# EasyEDA Pro project easyeda-pro-v2.2-format-example.epro

# Schematic Schematic1

## Sheets
1 P1: Board Name: Board1; Create Date: 2026-08-03; Page Name: P1; Project Name: easyeda-pro-v2.2-format-example; Schematic Name: Schematic1; Update Date: 2026-08-03; Company: 嘉立创EDA; Page Size: A4; Version: V1.0
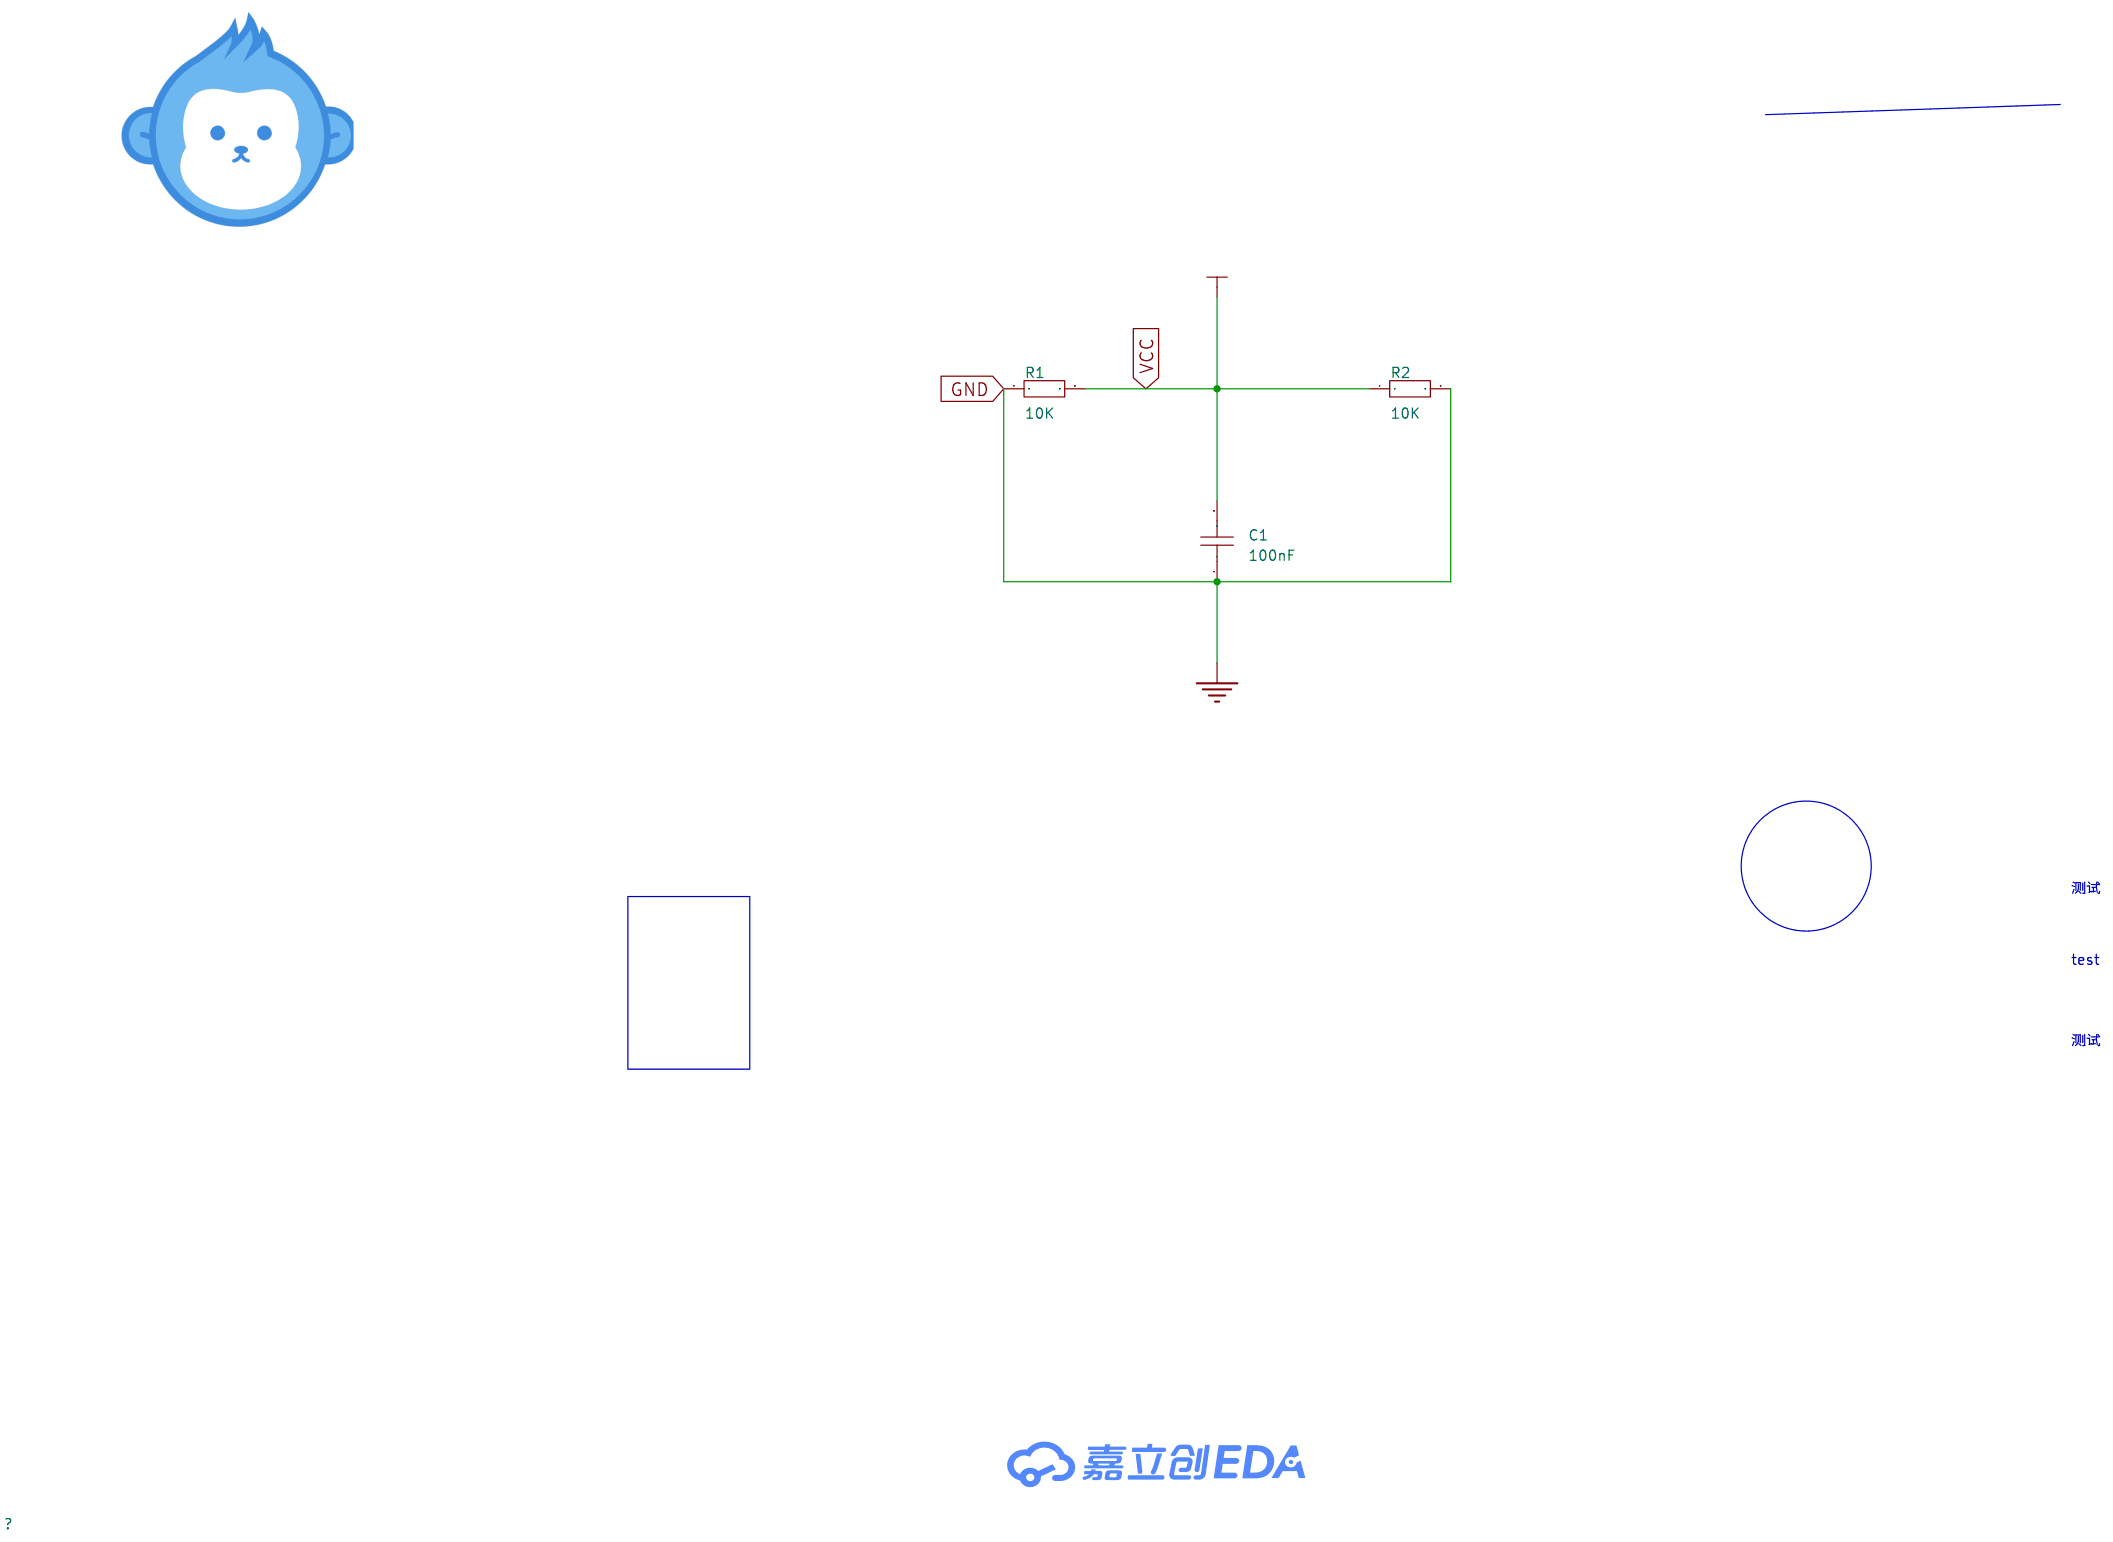
[diagram p0: P1]
2 P2: Page Name: P2
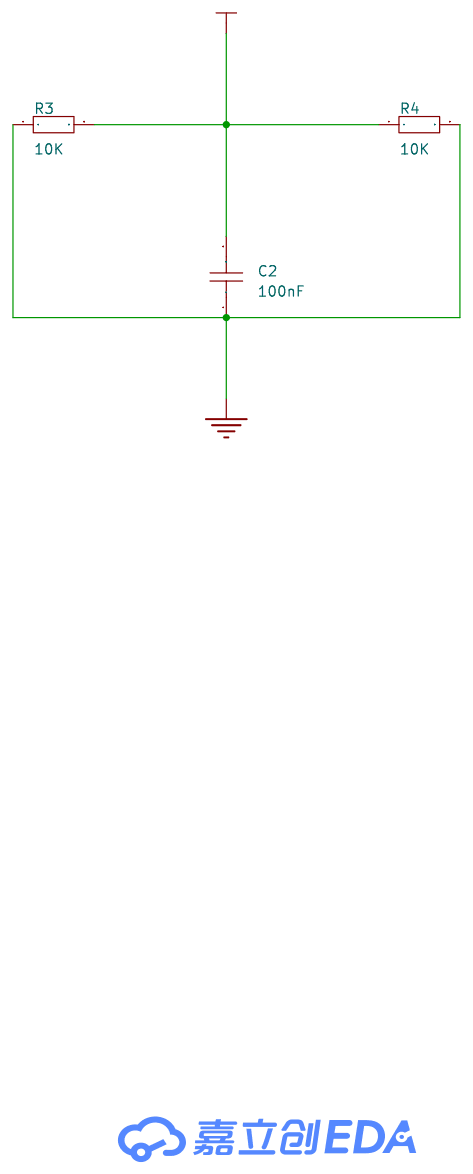
[diagram p1: P2]

## Parts
sheet P1
C1  100nF  [C0603]
R1  10K  [R0603]
R2  10K  [R0603]
sheet P2
C2  100nF  [C0603]
R3  10K  [R0603]
R4  10K  [R0603]

## Library data of the parts
C1 C2 = CAP_0603: Supplier Footprint: 0603
R1-R4 = Res_0603: Supplier Footprint: 0603

## Nets
GND: C1.1 C2.1 R1.1 R2.2 R3.1 R4.2
VCC: C1.2 C2.2 R1.2 R2.1 R3.2 R4.1

## Notes on the sheets
sheet 1
- 测试
- test
- 测试

# Schematic Schematic2
Board Name: Board2; Create Date: 2026-08-03; Page Name: P1; Project Name: easyeda-pro-v2.2-format-example; Schematic Name: Schematic2; Update Date: 2026-08-03; Company: 嘉立创EDA; Page Size: A4; Version: V1.0
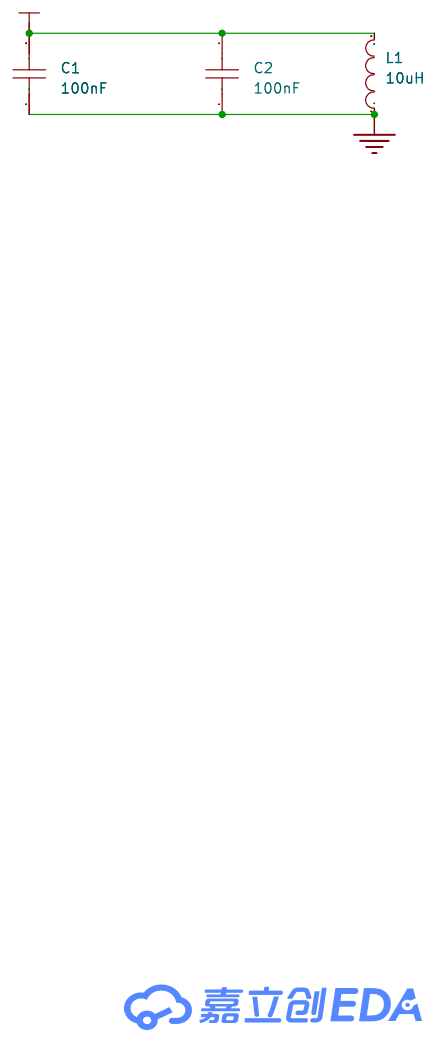
[diagram p2: schematic sheet]

## Parts
C1  100nF  [C0603]
C2  100nF  [C0603]
L1  10uH  [L0603]

## Library data of the parts
C1 C2 = CAP_0603: Supplier Footprint: 0603
L1 = L_0603

## Nets
GND: C1.1 C2.1 L1.1
VCC: C1.2 C2.2 L1.2

# Board PCB1
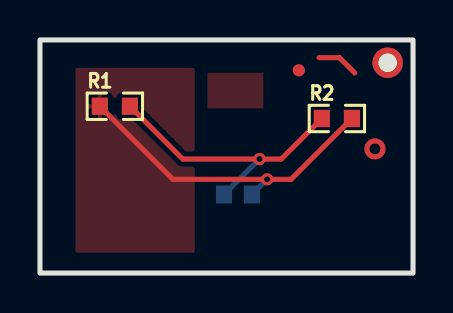
[diagram p3: board, top side]
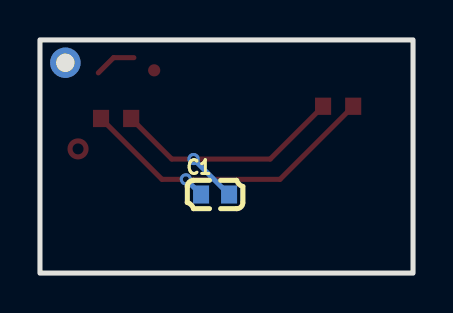
[diagram p4: board, bottom side, seen from below]

Outline 18.67 x 11.68 mm; copper layers: Top Layer, Inner1, Inner2, Bottom Layer. Coordinates in mm from the lower left corner of the outline.
Outline path: rectangle 0,11.68 18.67,0
Stack: Top Layer 0.035mm / Dielectric1 0.48mm PP er 4.5 / Inner1 0.035mm / Dielectric2 0.48mm FR4 er 4.5 / Inner2 0.035mm / Dielectric3 0.48mm PP er 4.5 / Bottom Layer 0.035mm

## Design rules (mm)
template: JLCPCB Capability(Two Layers Board)
spacing copperThickness1oz (default): track to track 0.102, other pairs 0.152 to 0.3
spacing copperThickness2oz: track to track 0.203, other pairs 0.152 to 0.3
track width copperThickness1oz (default): min 0.127, default 0.254, max 2.54
track width copperThickness2oz: min 0.203, default 0.254, max 2.54
differential pair differentialPair (default): width min 0.127, default 0.254, max 2.54; gap min 0.152, default 0.152
via viaSize (default): diameter min 0.5, default 0.61, max 10; hole min 0.3, default 0.305, max 6.3

## Placement (name value [footprint] x y rotation side)
C1  100nF  [C0603]  9.91 3.94 180 bottom
NOREF  -  [Pad_e44]  12.95 10.16 0 top
NOREF#2  -  [Pad_e37]  17.4 10.54 0 top
R1  10K  [R0603]  3.75 8.36 0 top
R2  10K  [R0603]  14.86 7.75 0 top

## Footprints (pads in the part's own frame, mm; a bottom-side part is the same pattern mirrored in y, then rotated)
C0603
  rect 0.8x0.9 smd: 1(-0.7,0) 2(0.7,0)
Pad_e37
  round 1.524 hole 0.914: 1(0,0)
Pad_e44
  round 0.61 smd: TP1(0,0)
R0603
  rect 0.806x0.864 smd: 1(-0.753,0) 2(0.753,0)

## Nets
As in the schematic.

Pads without a net: NOREF TP1; NOREF#2 1

## Via types
v1: diameter 0.61, hole 0.305, Top Layer to Bottom Layer, 2 vias

## Routing (per net, layer and track width the routed paths; a pad name or vN(x,y) marks a point on that pad's centre or on a via; arc(x,y) is an arc through that point)
GND: length 16.5
  Top Layer w0.254: R1.1 6.66,4.7 v1(11.37,4.7) 12.56,4.7 R2.2
  Bottom Layer w0.254: C1.1 v1(11.37,4.7)
VCC: length 14.1
  Top Layer w0.254: R2.1 12.07,5.72 v1(10.98,5.72) 7.15,5.72 R1.2
  Bottom Layer w0.254: C1.2 v1(10.98,5.72)

## Copper pours and planes (outline as drawn; the poured copper is in the pictures)
GND on Top Layer: 1.78,10.29 7.75,10.29 7.75,1.02 1.78,1.02
GND on Inner2: 0.26,11.43 18.41,11.43 18.41,0.26 0.26,0.26
(no net) on Top Layer: 8.38,10.03 11.18,10.03 11.18,8.25 8.38,8.25

Small or netless copper shapes (teardrops, artwork), in the pictures only: 1 on Inner2

# Board PCB2
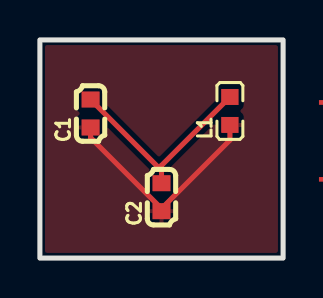
[diagram p5: board, top side]
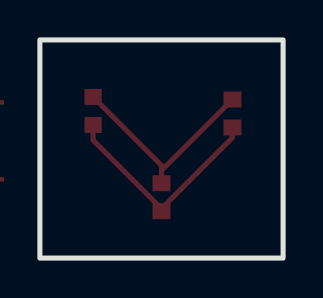
[diagram p6: board, bottom side, seen from below]

Outline 12.19 x 10.92 mm; copper layers: Top Layer, Bottom Layer. Coordinates in mm from the lower left corner of the outline.
Outline path: rectangle 0,10.92 12.19,0
Stack: Top Layer 0.035mm / Dielectric1 1.51mm FR4 er 4.5 / Bottom Layer 0.035mm

## Design rules (mm)
template: JLCPCB Capability(Two Layers Board)
spacing copperThickness1oz (default): track to track 0.102, other pairs 0.152 to 0.3
spacing copperThickness2oz: track to track 0.203, other pairs 0.152 to 0.3
track width copperThickness1oz (default): min 0.127, default 0.254, max 2.54
track width copperThickness2oz: min 0.203, default 0.254, max 2.54
differential pair differentialPair (default): width min 0.127, default 0.254, max 2.54; gap min 0.152, default 0.152
via viaSize (default): diameter min 0.5, default 0.61, max 10; hole min 0.3, default 0.305, max 6.3

## Placement (name value [footprint] x y rotation side)
C1  100nF  [C0603]  2.54 7.24 90 top
C2  100nF  [C0603]  6.1 3.05 90 top
L1  10uH  [L0603]  9.53 7.37 90 top

## Footprints (pads in the part's own frame, mm; a bottom-side part is the same pattern mirrored in y, then rotated)
C0603
  rect 0.8x0.9 smd: 1(-0.7,0) 2(0.7,0)
L0603
  rect 0.8x0.864 smd: 1(-0.7,0) 2(0.7,0)

## Nets
As in the schematic.

## Routing (per net, layer and track width the routed paths; a pad name or vN(x,y) marks a point on that pad's centre or on a via; arc(x,y) is an arc through that point)
GND: length 11.3
  Top Layer w0.254: 6.1,2.48 6.1,2.35 ; 6.1,2.48 9.53,5.9 L1.1 ; 6.1,2.48 2.54,6.03 C1.1
VCC: length 10.8
  Top Layer w0.254: L1.2 6.1,4.64 6.1,4.38 ; 6.1,4.38 C2.2 ; 6.1,4.38 C1.2

## Copper pours and planes (outline as drawn; the poured copper is in the pictures)
GND on Top Layer: -0.38,11.3 12.57,11.3 12.57,-0.38 -0.38,-0.38

Small or netless copper shapes (teardrops, artwork), in the pictures only: 4 on Top Layer

## Text on the board
Top Layer: test
